# Altium schematic sheet Microphone.SchDoc: Microphone
size Letter; DrawnBy: D. Fusi; DocumentNumber: 1; Revision: 1; SheetNumber: 1; SheetTotal: 3
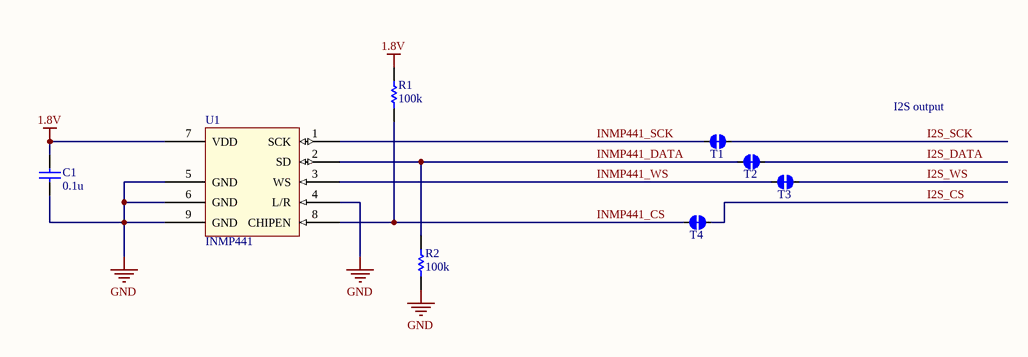
[diagram p0: Microphone.SchDoc]

## Parts
C1  0.1u  [CAP0201]
R1  100k  [RES0201]
R2  100k  [RES0201]
T1  Solderbridge_short_1mm  [Solderbridge_short_1mm]  (value not drawn)
T2  Solderbridge_short_1mm  [Solderbridge_short_1mm]  (value not drawn)
T3  Solderbridge_short_1mm  [Solderbridge_short_1mm]  (value not drawn)
T4  Solderbridge_short_1mm  [Solderbridge_short_1mm]  (value not drawn)
U1  INMP441  [INMP441]

## Nets
1.8V: C1.2 R1.2 U1.7(VDD)
GND: C1.1 R2.1 U1.4(L/R) U1.5(GND) U1.6(GND) U1.9(GND)
I2S_CS: T4.2
I2S_DATA: T2.2
I2S_SCK: T1.2
I2S_WS: T3.2
INMP441_CS: R1.1 T4.1 U1.8(CHIPEN)
INMP441_DATA: R2.2 T2.1 U1.2(SD)
INMP441_SCK: T1.1 U1.1(SCK)
INMP441_WS: T3.1 U1.3(WS)

## Notes on the sheet
- I2S output
- TITLE
- DATE
- DRAWN BY
- REV
- SHEET
- OF

## Library data of the parts
C1 = C_0.1u_10_6.3_X5R_0201: Chip capacitor; Vendor: Taiyo Yuden; PN: JMK063BJ104KP-F; Tolerance: 10%; Voltage: 6.3; Temp: X5R; Value: 0.1u; Size: 0201
R1 R2 = R_100k_5_0.05_0201: Chip Resistor; Vendor: Panasonic; Tolerance: 5 %; Power: 0.05 W; PN: ERJ-1GEJ104C; Model: *; Value: 100k; Size: 0201
T1-T4 = Solderbridge_short_1mm: Solderbridge, shorted
U1 = INMP441: Omnidirectional digital microphone with I2S interface; Vendor: InvenSense; PN: INMP441